# Altium schematic sheet BatteryProtection.SchDoc
size A3
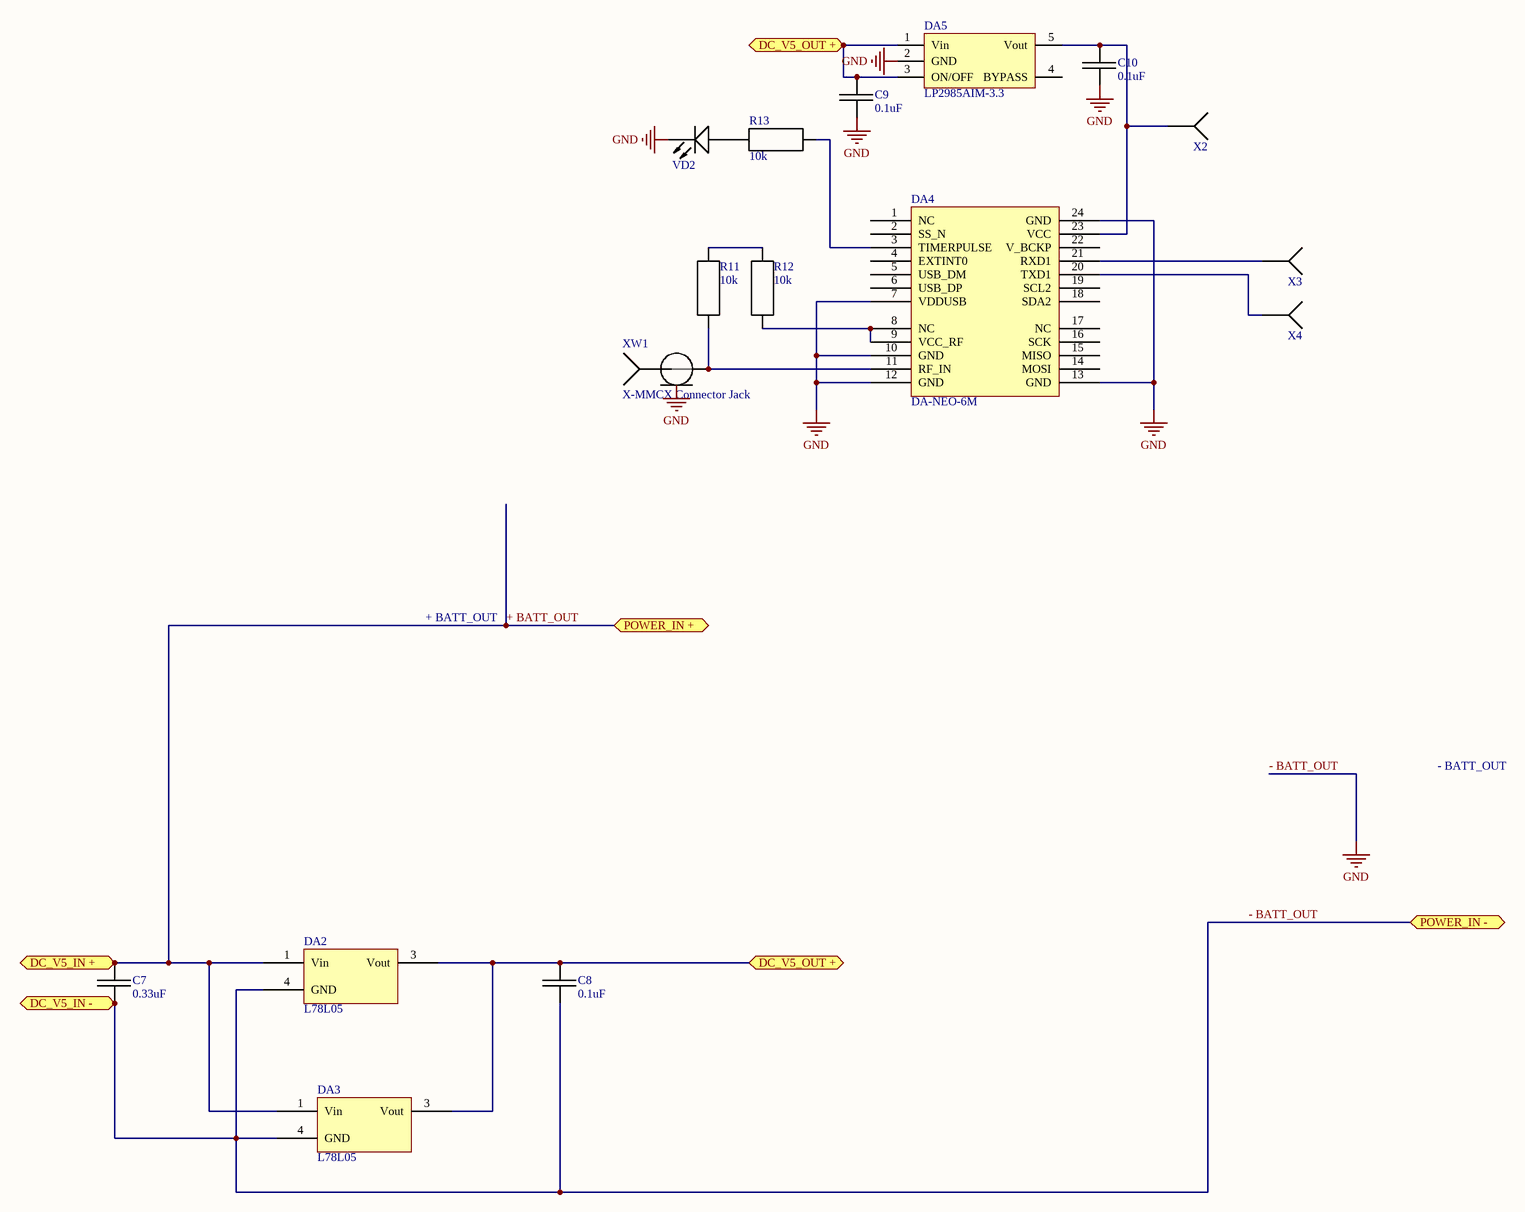
[diagram p0: BatteryProtection.SchDoc]

## Parts
C7  0.33uF  [CAP0805]
C8  0.1uF  [CAP0805]
C9  0.1uF  [CAP0805]
C10  0.1uF  [CAP0805]
DA2  L78L05  [TO-252AA]
DA3  L78L05  [TO-252AA]
DA4  DA-NEO-6M  [NEO-6M]
DA5  LP2985AIM-3.3  [SOT-23]
R11  10k  [RES0805]
R12  10k  [RES0805]
R13  10k  [RES0805]
VD2  KP-1608SURC  [Diode 1608]  (value not drawn)
X2  X-Socket  [Socket]  (value not drawn)
X3  X-Socket  [Socket]  (value not drawn)
X4  X-Socket  [Socket]  (value not drawn)
XW1  X-MMCX Connector Jack  [X-MMCX]

## Ports
DC_V5_IN +, DC_V5_IN -, DC_V5_OUT +, POWER_IN +, POWER_IN -

## Nets
- BATT_OUT: C7.2 C8.2 C9.2 C10.2 DA2.4(GND) DA3.4(GND) DA4.7(VDDUSB) DA4.10(GND) DA4.12(GND) DA4.13(GND) DA4.24(GND) DA5.2(GND) VD2.1 XW1.2 ; port DC_V5_IN -, port POWER_IN -  [also labelled GND]
+ BATT_OUT: C7.1 DA2.1(Vin) DA3.1(Vin) ; port DC_V5_IN +, port POWER_IN +
DC_V5_OUT +: C8.1 C9.1 DA2.3(Vout) DA3.3(Vout) DA5.1(Vin) DA5.3(ON/OFF) ; port DC_V5_OUT +
NetC10_1: C10.1 DA4.23(VCC) DA5.5(Vout) X2.1
NetDA4_3: DA4.3(TIMERPULSE) R13.2
NetDA4_8: DA4.8(NC) DA4.9(VCC_RF) R12.2
NetDA4_11: DA4.11(RF_IN) R11.2 XW1.1
NetDA4_20: DA4.20(TXD1) X4.1
NetDA4_21: DA4.21(RXD1) X3.1
NetR11_1: R11.1 R12.1
NetR13_1: R13.1 VD2.2

Not connected (* = marked no-connect by the designer): DA4 1(NC) 2(SS_N) 4(EXTINT0) 5(USB_DM) 6(USB_DP) 14(MOSI) 15(MISO) 16(SCK) 17(NC) 18(SDA2) 19(SCL2) 22(V_BCKP); DA5 4(BYPASS)

## Notes on the sheet
- + BATT_OUT
- - BATT_OUT

## Library data of the parts
C7-C10 = Capacitor: Voltage: 50V; dielectric: X7R
  C7: Value: 0.33uF
  C8-C10: Value: 0.1uF
DA2 DA3 = DA-L78M05: LDO; Iout: 0.5A; Vin max: 35 V; Vout: 5V
DA5 = DA-LP2985: LDO; Iout: 0.15A; Vin max: 16 V
R11-R13 = Resistor: Toleance: 1%; Value: 10k
VD2 = LED_0603: Imax: 30mA; Inorm: 20mA